# EAGLE design slipring (EAGLE 7.6.0)
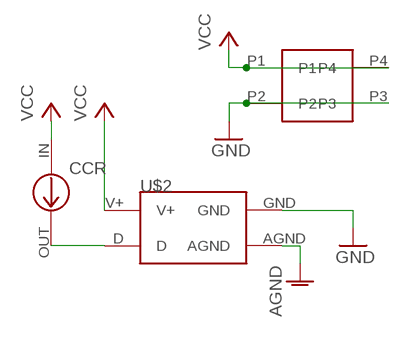
[diagram p0: schematic, sheet 1]

## Parts
CCR  CCR  [CCR]
CONN  BOURNS_2PIN  [BOURNS_2PIN]
U$2  RING3  [RING3]

## Nets
AGND: U$2.AGND
GND: CONN.P2 CONN.P3 U$2.GND
N$3: CCR.OUT U$2.D
VCC: CCR.IN CONN.P1 CONN.P4 U$2.V+

## Library data of the parts
CCR = CUSTOM:CCR
CONN = CUSTOM:BOURNS_2PIN
U$2 = CUSTOM:RING3

## Board
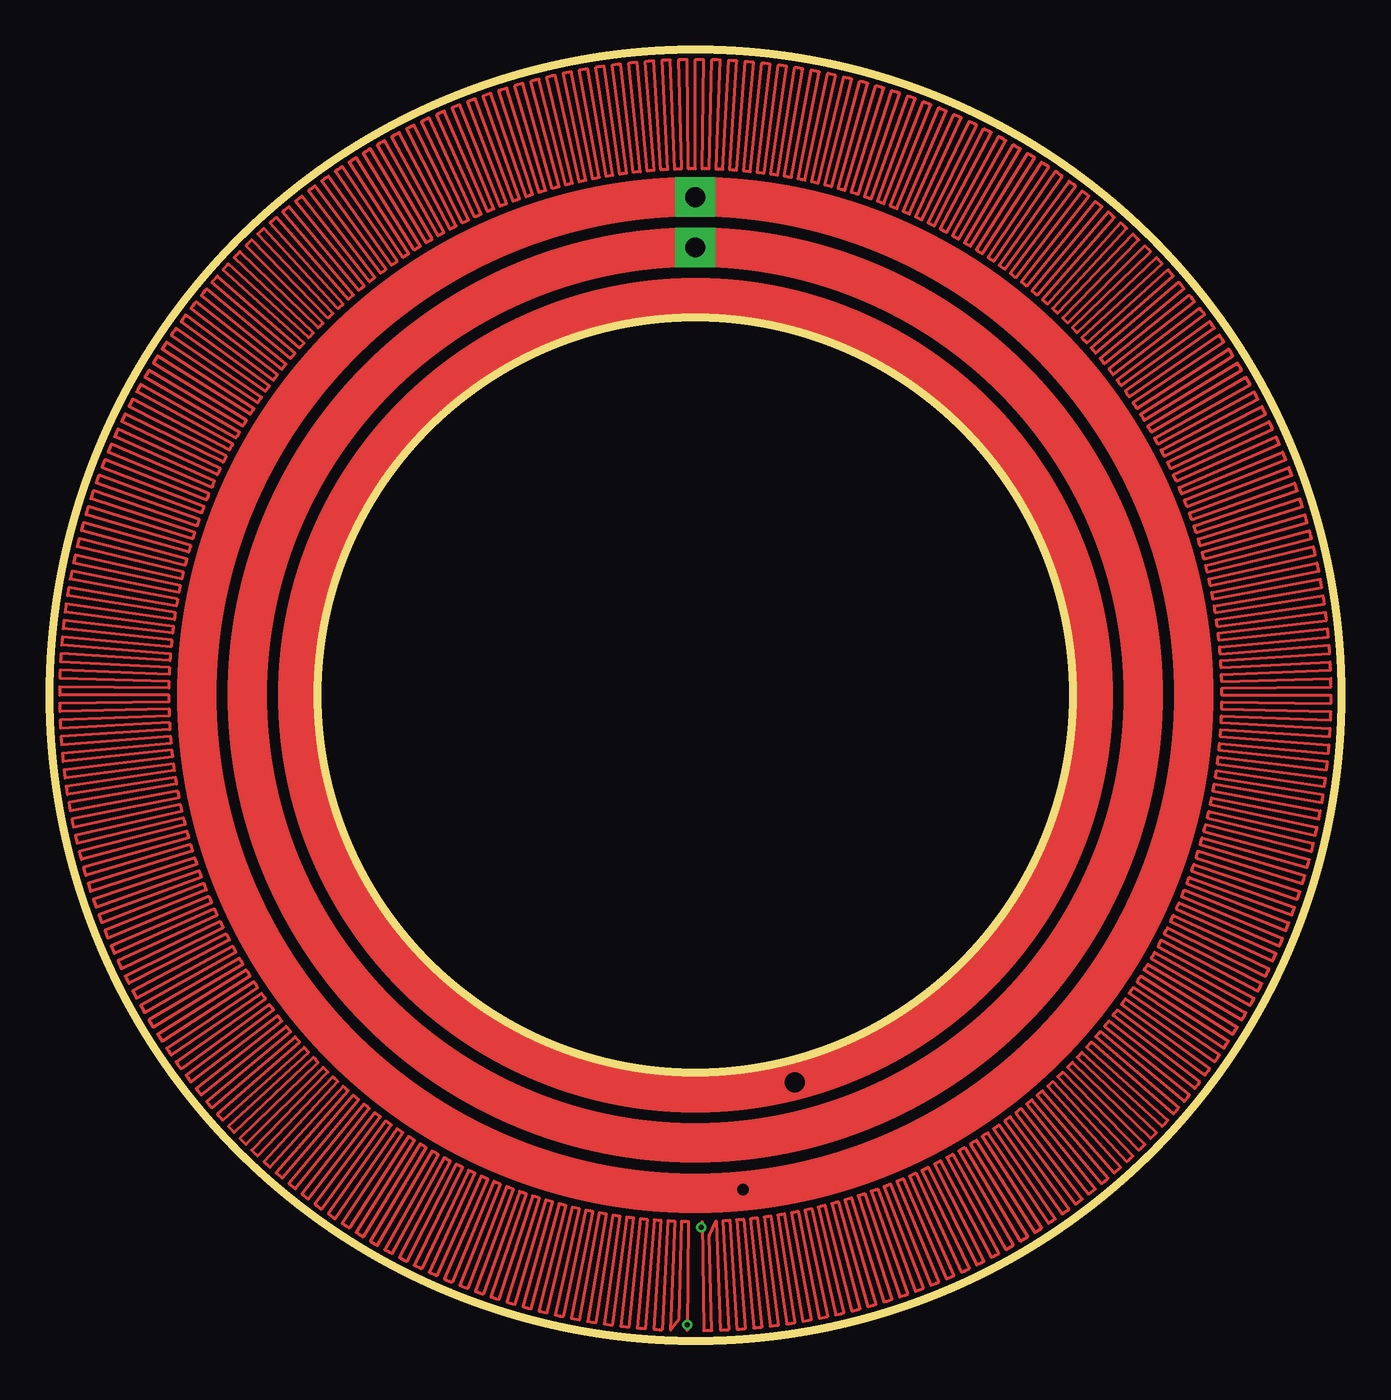
[diagram p1: board, top side]
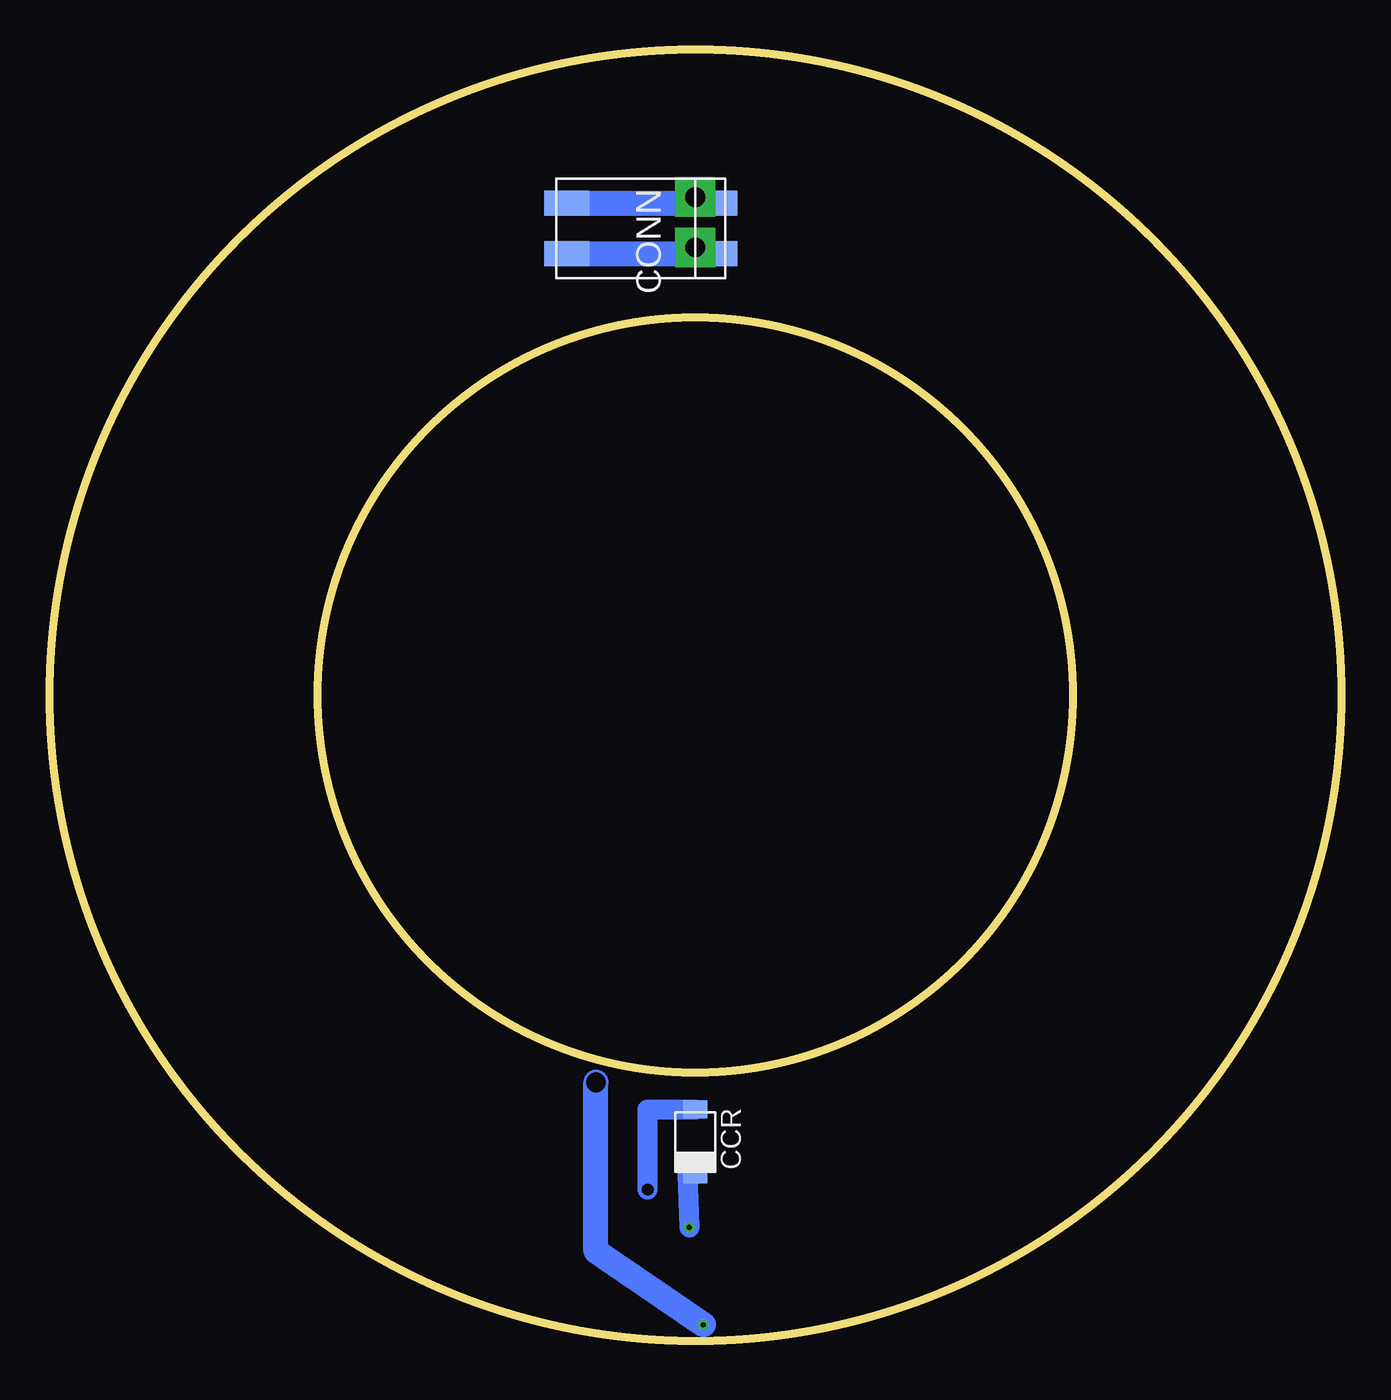
[diagram p2: board, bottom side, seen from below]

Size 65 x 65 mm. Coordinates in mm from the lower left corner, seen from the top.
Outline: circle at 32.5,32.5 radius 19
Outline: circle at 32.5,32.5 radius 32.5
Copper layers (1*16): Top 0.035mm / dielectric 1.5mm / Bottom 0.035mm
Design rules "default *": minimum track width 10mil, minimum drill 24mil, track to track 8mil, track to pad 8mil, pad to pad 8mil, via to via 8mil, smd to smd 8mil, copper to edge 40mil, drill to drill 8mil, minimum pad ring 0mil, minimum via ring 0mil, stop-mask expansion 4mil, vias tented up to drill 0mil, thermal gap 10mil

### Footprints (pad centres in the part's own frame; a part is rotated, then mirrored left to right if it is on the bottom)
CCR = smd 0.91 x 1.22: IN 1.637,0; OUT -1.637,0
BOURNS_2PIN = smd 1.27 x 2.26: P1 -1.27,0.97; P2 1.27,0.97; P3 1.27,-6.47; P4 -1.27,-6.47
RING3 = drill 1: AGND 5,-19.5 | drill 0.254 pad 0.508: AGND_PIN -0.4,-31.7; D 0.3,-26.8 | drill 1 pad 2 square: GND 0,22.54; V+ 0,25.08

### Placement (x,y rotation side)
CCR  32.5,10 90 bottom
CONN  32.5,56 270 bottom
U$2  32.5,32.5 0 top

### Tracks (layer width: path | path; a pad name or v marks a point on that pad's centre or on a via)
GND
  Bottom 1.016: CONN.P2 U$2.GND
  Bottom 1.27: CONN.P3 32.5,54.73 U$2.GND
N$3
  Bottom 1.016: CCR.OUT 32.9,8.36 U$2.D
VCC  (via drill 0.6)
  Top 0.406: v34.9,7.6 48,12 55,22 58,31 56,43 47,53 38,57 U$2.V+
  Bottom 1.016: CONN.P1 U$2.V+ | v34.9,7.6 34.9,11.64 CCR.IN
  Bottom 1.27: CONN.P4 32.5,57.27 U$2.V+